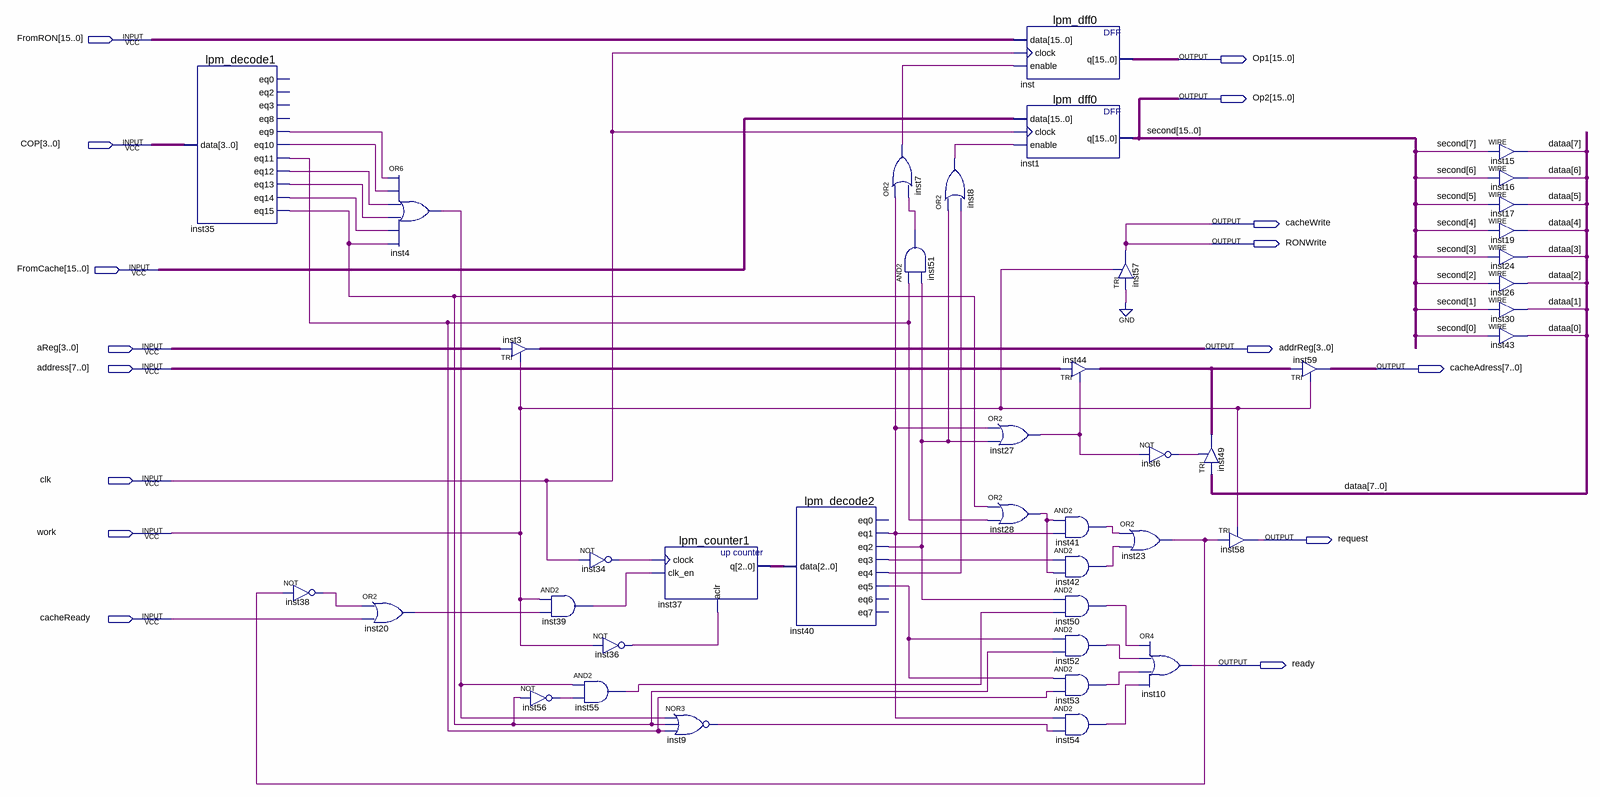
[diagram p0: schematic sheet]
// Quartus schematic GetOperands.bdf as structural Verilog: 42 symbols, 16 pins
module GetOperands (
  input  [15:0] FromRON,
  input  [3:0] COP,
  input  [15:0] FromCache,
  input  [3:0] aReg,
  input  [7:0] address,
  input  clk,
  input  work,
  input  cacheReady,
  output [15:0] Op1,
  output [15:0] Op2,
  output cacheWrite,
  output RONWrite,
  output [3:0] addrReg,
  output [7:0] cacheAdress,
  output request,
  output ready
);

  wire inst4_out, inst6_out, inst7_out, inst8_out, inst9_out, inst20_out, inst23_out, inst27_out, inst28_out,
       inst34_out, inst35_eq9, inst35_eq10, inst35_eq11, inst35_eq12, inst35_eq13, inst35_eq14, inst35_eq15,
       inst36_out, inst38_out, inst39_out, inst40_eq1, inst40_eq2, inst40_eq3, inst40_eq4, inst40_eq5,
       inst41_out, inst42_out, inst50_out, inst51_out, inst52_out, inst53_out, inst54_out, inst55_out,
       inst56_out;
  wire [2:0] inst37_q;
  wire [7:0] dataa, inst44_out;

  lpm_decode1 inst35 (
    .data(COP), .eq9(inst35_eq9), .eq10(inst35_eq10), .eq11(inst35_eq11), .eq12(inst35_eq12),
    .eq13(inst35_eq13), .eq14(inst35_eq14), .eq15(inst35_eq15));  // open: eq0, eq2, eq3, eq8
  not inst38 (inst38_out, inst23_out);
  or inst20 (inst20_out, inst38_out, cacheReady);
  or inst4 (inst4_out, inst35_eq9, inst35_eq10, inst35_eq12, inst35_eq13, inst35_eq14, inst35_eq15);
  TRI inst3[3:0] (.IN(aReg), .OE(work), .OUT(addrReg));
  not inst56 (inst56_out, inst35_eq15);
  not inst34 (inst34_out, clk);
  and inst39 (inst39_out, work, inst20_out);
  and inst55 (inst55_out, inst4_out, inst56_out);
  not inst36 (inst36_out, work);
  lpm_counter1 inst37 (.clock(inst34_out), .clk_en(inst39_out), .aclr(inst36_out), .q(inst37_q));
  nor inst9 (inst9_out, inst4_out, inst35_eq15, inst35_eq11);
  lpm_decode2 inst40 (
    .data(inst37_q), .eq1(inst40_eq1), .eq2(inst40_eq2), .eq3(inst40_eq3), .eq4(inst40_eq4), .eq5(inst40_eq5));  // open: eq0, eq6, eq7
  or inst7 (inst7_out, inst40_eq1, inst51_out);
  and inst51 (inst51_out, inst35_eq11, inst40_eq2);
  or inst8 (inst8_out, inst40_eq2, inst40_eq4);
  or inst27 (inst27_out, inst40_eq1, inst40_eq2);
  or inst28 (inst28_out, inst35_eq15, inst35_eq11);
  lpm_dff0 inst (.data(FromRON), .clock(clk), .enable(inst7_out), .q(Op1));
  lpm_dff0 inst1 (.data(FromCache), .clock(clk), .enable(inst8_out), .q(Op2));
  TRI inst44[7:0] (.IN(address), .OE(inst27_out), .OUT(inst44_out));
  and inst41 (inst41_out, inst28_out, inst40_eq1);
  and inst42 (inst42_out, inst40_eq3, inst28_out);
  and inst50 (inst50_out, inst40_eq2, inst55_out);
  and inst52 (inst52_out, inst40_eq5, inst35_eq15);
  and inst53 (inst53_out, inst40_eq5, inst35_eq11);
  and inst54 (inst54_out, inst40_eq1, inst9_out);
  TRI inst57 (.IN(1'b0), .OE(work), .OUT(cacheWrite));
  not inst6 (inst6_out, inst27_out);
  or inst23 (inst23_out, inst41_out, inst42_out);
  or inst10 (ready, inst50_out, inst52_out, inst53_out, inst54_out);
  TRI inst49[7:0] (.IN(dataa), .OE(inst6_out), .OUT(inst44_out));
  TRI inst58 (.IN(inst23_out), .OE(work), .OUT(request));
  TRI inst59[7:0] (.IN(inst44_out), .OE(work), .OUT(cacheAdress));
  assign dataa[7] = Op2[7];  // WIRE inst15
  assign dataa[6] = Op2[6];  // WIRE inst16
  assign dataa[5] = Op2[5];  // WIRE inst17
  assign dataa[4] = Op2[4];  // WIRE inst19
  assign dataa[3] = Op2[3];  // WIRE inst24
  assign dataa[2] = Op2[2];  // WIRE inst26
  assign dataa[1] = Op2[1];  // WIRE inst30
  assign dataa[0] = Op2[0];  // WIRE inst43

  assign RONWrite = cacheWrite;

  // Other names for the same wires on the sheet: second[15:0] = Op2
endmodule
